# EAGLE schematic HeaterCotrol (EAGLE 7.5.0)
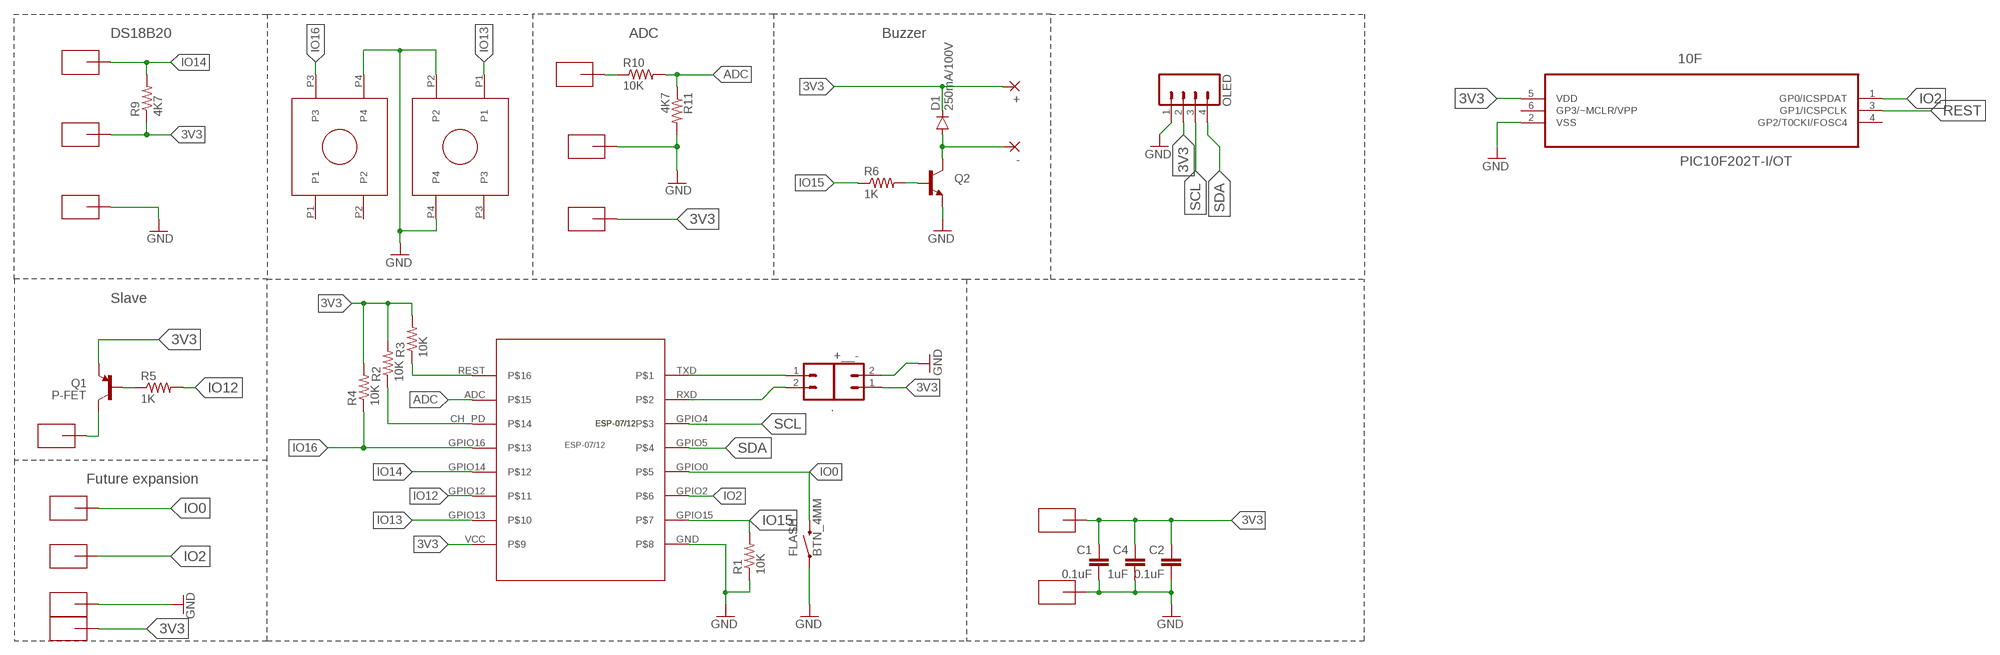
[diagram p0: schematic, sheet 1]

## Parts
10F  PIC10F202T-I/OT  [SOT95P270X145-6N]
+  1,6/0,8  [1,6/0,8]
+__-  M02PTH  [1X02]
-  1,6/0,8  [1,6/0,8]
.  M02PTH  [1X02]
C1  0.1uF  CAP  [0805-CAP]
C2  0.1uF  CAP  [0805-CAP]
C4  1uF  CAP  [0805-CAP]
D1  250mA/100V  DIODEBAS16  [SOD-323]
FLASH  BTN_4MM  [BTN_4MM]
LEFT  OMROM_TH  [OMROM_TH]
OLED  M04PTH  [1X04]
Q1  P-FET  TRANSISTOR_PNPSMD  [SOT23-3]
Q2  TRANSISTOR_NPNSOT23-3  [SOT23-3]
R1  10K  RESISTOR0805-RES  [0805]
R2  10K  RESISTOR0805-RES  [0805]
R3  10K  RESISTOR0805-RES  [0805]
R4  10K  RESISTOR0805-RES  [0805]
R5  1K  RESISTOR0805-RES  [0805]
R6  1K  RESISTOR0805-RES  [0805]
R9  4K7  RESISTOR0805-RES  [0805]
R10  10K  RESISTOR0805-RES  [0805]
R11  4K7  RESISTOR0805-RES  [0805]
RIGHT  OMROM_TH  [OMROM_TH]
U$1  ESP-07/12  [ESP-07/12]
U$2  SMD-PAD1  [SMD-PAD1]
U$3  SMD-PAD1  [SMD-PAD1]
U$4  SMD-PAD1  [SMD-PAD1]
U$5  SMD-PAD1  [SMD-PAD1]
U$6  SMD-PAD1  [SMD-PAD1]
U$7  SMD-PAD1  [SMD-PAD1]
U$8  SMD-PAD1  [SMD-PAD1]
U$9  SMD-PAD1  [SMD-PAD1]
U$10  SMD-PAD1  [SMD-PAD1]
U$11  SMD-PAD1  [SMD-PAD1]
U$12  SMD-PAD1  [SMD-PAD1]
U$13  SMD-PAD1  [SMD-PAD1]
U$14  SMD-PAD1  [SMD-PAD1]

## Nets
3V3: 10F.5(VDD) +.1(P) +__-.1 C1.1 C2.1 C4.1 D1.C OLED.2 Q1.2(E) R2.2 R3.2 R4.2 R9.1 U$1.VCC U$3.>NAME U$5.>NAME U$8.>NAME U$9.>NAME
ADC: R10.2 R11.1 U$1.ADC
GND: 10F.2(VSS) +__-.2 C1.2 C2.2 C4.2 FLASH.1 LEFT.P4 OLED.1 Q2.2(E) R1.1 R11.2 RIGHT.P2 RIGHT.P4 U$1.GND U$4.>NAME U$6.>NAME U$11.>NAME U$13.>NAME
IO0: FLASH.2 U$1.GPIO0 U$14.>NAME
IO2: 10F.1(GP0/ICSPDAT) U$1.GPIO2 U$12.>NAME
IO12: R5.2 U$1.GPIO12
IO13: RIGHT.P1 U$1.GPIO13
IO14: R9.2 U$1.GPIO14 U$10.>NAME
IO15: R1.2 R6.1 U$1.GPIO15
IO16: LEFT.P3 R4.1 U$1.GPIO16
N$1: Q1.3(C) U$2.>NAME
N$2: Q2.1(B) R6.2
N$4: -.1(P) D1.A Q2.3(C)
N$6: Q1.1(B) R5.1
N$7: R10.1 U$7.>NAME
N$11: R2.1 U$1.CH_PD
REST: 10F.3(GP1/ICSPCLK) R3.1 U$1.REST
RXD: ..2 U$1.RXD
SCL: OLED.3 U$1.GPIO4
SDA: OLED.4 U$1.GPIO5
TXD: ..1 U$1.TXD
Unconnected: 10F.4(GP2/T0CKI/FOSC4) 10F.6(GP3/~MCLR/VPP) LEFT.P1 LEFT.P2 RIGHT.P3

## Notes on the sheet
- DS18B20 | ADC | Buzzer
- Slave
- Future expansion

## Library data of the parts
10F = Microchip_By_element14_Batch_1:PIC10F202T-I/OT: 8-bit Flash Microcontroller; MPN: PIC10F202T-I/OT; OC_FARNELL: 9942874; OC_NEWARK: 07J7310; PACKAGE: SOT-6; SUPPLIER: Microchip Technology
+ - = wirepad:1,6/0,8: THROUGH-HOLE PAD
+__- . = SparkFun-Connectors:M02: Standard 2-pin 0.1" header. Use with - straight break away headers ( PRT-00116) - right angle break away headers (PRT-00553) - swiss pins (PRT-00743) - machine pins (PRT-00117) - female headers (PRT-00115) Molex polarized connector foot print use with: PRT-08233 with associated crimp pins and housings. 2.54_SCREWTERM for use with PRT-10571. 3.5mm Screw Terminal footprints for PRT-08084 5mm Screw Terminal footprints for use with PRT-08432
C1 C2 C4 = SparkFun-Capacitors:CAP: Capacitor Standard 0603 ceramic capacitor, and 0.1" leaded capacitor.
D1 = SparkFun-DiscreteSemi:DIODE: Diode These are standard reverse protection diodes and small signal diodes. SMA package can handle up to about 1A. SOD-323 can handle about 200mA. What the SOD-323 package when ordering, there are some mfgs out there that are 5-pin packages.; PROD_ID: DIO-09646
FLASH = CuriousTech:BTN_4MM
LEFT RIGHT = CuriousTech:OMROM_TH: C&K KSA0M211 LFT + cap BTNK0120 (untested)
OLED = SparkFun-Connectors:M04: Header 4 Standard 4-pin 0.1" header. Use with straight break away headers (SKU : PRT-00116), right angle break away headers (PRT-00553), swiss pins (PRT-00743), machine pins (PRT-00117), and female headers (PRT-00115). Molex polarized connector foot print use with SKU : PRT-08231 with associated crimp pins and housings. 1MM SMD Version SKU: PRT-10208
Q1 = SparkFun-DiscreteSemi:TRANSISTOR_PNP: Generic PNP BJT Double check pinouts against datasheets- not all devices are the same! MMBT3906 - 40V 200mA SOT-23 (TRANS-08052) MMBT4403 - 40V 600mA SOT-23 (TRANS-09245)
Q2 = SparkFun-DiscreteSemi:TRANSISTOR_NPN: Generic NPN BJT MMBT2222A - TRANS-08049 (SOT-23, 1A 40V) MPSA42 - TRANS-09116 (SOT-23, 500mA 300V) MMBT5088LT1G - TRANS-11160 (SOT-23, 50 mA 30V) BC547 - COM-08928 <http://www.sparkfun.com/products/8928> (TO-92 45V 100mA) (1.Collector 2.Base 3.Emitter) 2N3904 - COM-00521 <http://www.sparkfun.com/products/521> (TO-92 40V 200mA) (1.Emitter 2.Base 3.Collector) P2N2222A - COM-12852 <http://www.sparkfun.com/products/12852> (TO-92 40V 600mA) (1.Collector 2.Base 3.Emitter); PROD_ID: TRANS-08049
R1-R6 R9-R11 = SparkFun-Resistors:RESISTOR: Resistor Basic schematic elements and footprints for 0603, 1206, and PTH resistors.
U$1 = ESP-07_12:ESP-07/12: Version 1.0 of the library for the ESP-07/12 full GPIO dev board module byME Jon jonnyradu@gmail.com
U$2-U$14 = CuriousTech:SMD-PAD1: SMD-PAD small